# Altium schematic sheet CAN.SchDoc: CAN Board
size 279 x 215 mm; Engineer: Prasoon Sinha; SheetNumber: 1; SheetTotal: 3
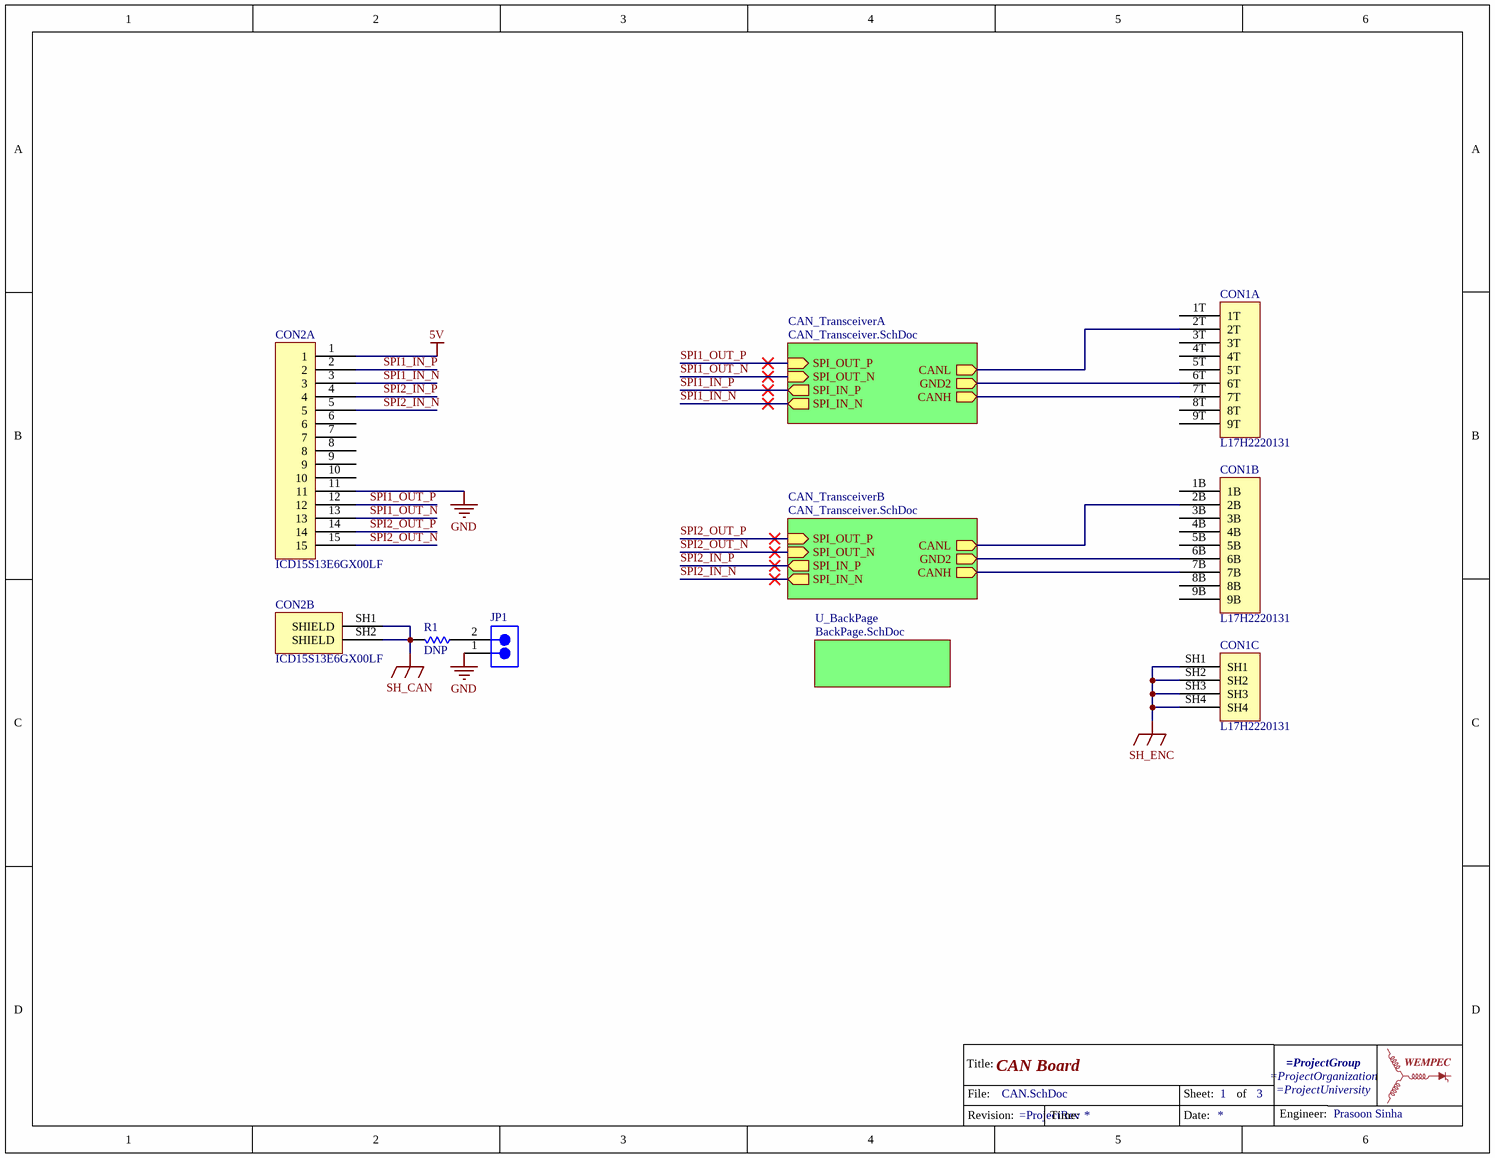
[diagram p0: CAN.SchDoc]

## Parts
*?  TitleBlockWEMPEC  (value not drawn)  (graphical)
CON1  L17H2220131  [L17H2220131]  (parts A,B,C of 3)
CON2  ICD15S13E6GX00LF  [ICD15S]  (parts A,B of 2)
JP1  Jumper2  [PIN_HEADER_1x2]  (value not drawn)
R1  value DNP  [0603_RES]  (hidden comment: Resistor)

## Sub-sheets
CAN_TransceiverA = CAN_Transceiver.SchDoc: SPI_IN_N (out), SPI_IN_P (out), SPI_OUT_N (in), SPI_OUT_P (in), CANH (out), CANL (out), GND2 (out)
CAN_TransceiverB = CAN_Transceiver.SchDoc: SPI_IN_N (out), SPI_IN_P (out), SPI_OUT_N (in), SPI_OUT_P (in), CANH (out), CANL (out), GND2 (out)
U_BackPage = BackPage.SchDoc: no entries

## Nets
5V: CON2.1
GND: CON2.11 JP1.1
SH_CAN: CON2.SH1(SHIELD) CON2.SH2(SHIELD) R1.2
SH_ENC: CON1.SH1 CON1.SH2 CON1.SH3 CON1.SH4
SPI1_IN_N: CON2.3 ; sheet CAN_TransceiverA/SPI_IN_N
SPI1_IN_P: CON2.2 ; sheet CAN_TransceiverA/SPI_IN_P
SPI1_OUT_N: CON2.13 ; sheet CAN_TransceiverA/SPI_OUT_N
SPI1_OUT_P: CON2.12 ; sheet CAN_TransceiverA/SPI_OUT_P
SPI2_IN_N: CON2.5 ; sheet CAN_TransceiverB/SPI_IN_N
SPI2_IN_P: CON2.4 ; sheet CAN_TransceiverB/SPI_IN_P
SPI2_OUT_N: CON2.15 ; sheet CAN_TransceiverB/SPI_OUT_N
SPI2_OUT_P: CON2.14 ; sheet CAN_TransceiverB/SPI_OUT_P
NetCON1_2B: CON1.2B ; sheet CAN_TransceiverB/CANL
NetCON1_2T: CON1.2T ; sheet CAN_TransceiverA/CANL
NetCON1_6B: CON1.6B ; sheet CAN_TransceiverB/GND2
NetCON1_6T: CON1.6T ; sheet CAN_TransceiverA/GND2
NetCON1_7B: CON1.7B ; sheet CAN_TransceiverB/CANH
NetCON1_7T: CON1.7T ; sheet CAN_TransceiverA/CANH
NetJP1_2: JP1.2 R1.1

Not connected (* = marked no-connect by the designer): CON1 1B 1T 3B 3T 4B 4T 5B 5T 8B 8T 9B 9T; CON2 6 7 8 9 10

## Notes on the sheet
- (in symbol TitleBlockWEMPEC) Title:; File:; Sheet:; of; Engineer:; Revision:; Time:; Date:

## Library data of the parts
CON1 = L17H2220131: CONN D-SUB RCPT 9POS R/A SLDR; Supplier Part 1: Digi-Key; Supplier Part Number 1: L17H2220131-ND
CON2 = ICD15S13E6GX00LF: CONN DSUB HD RCPT 15POS R/A SLDR; Supplier 1: Digi-Key; Supplier Part Number 1: 609-2801-ND
JP1 = Jumper2: Supplier 1: Digi-Key; Supplier Part Number 1: 732-5315-ND
R1 = Resistor: Supplier 1: Digi-Key; Supplier Part Number 1: P0.0GDKR-ND